# EAGLE schematic Rapide328smd (EAGLE 6.3)
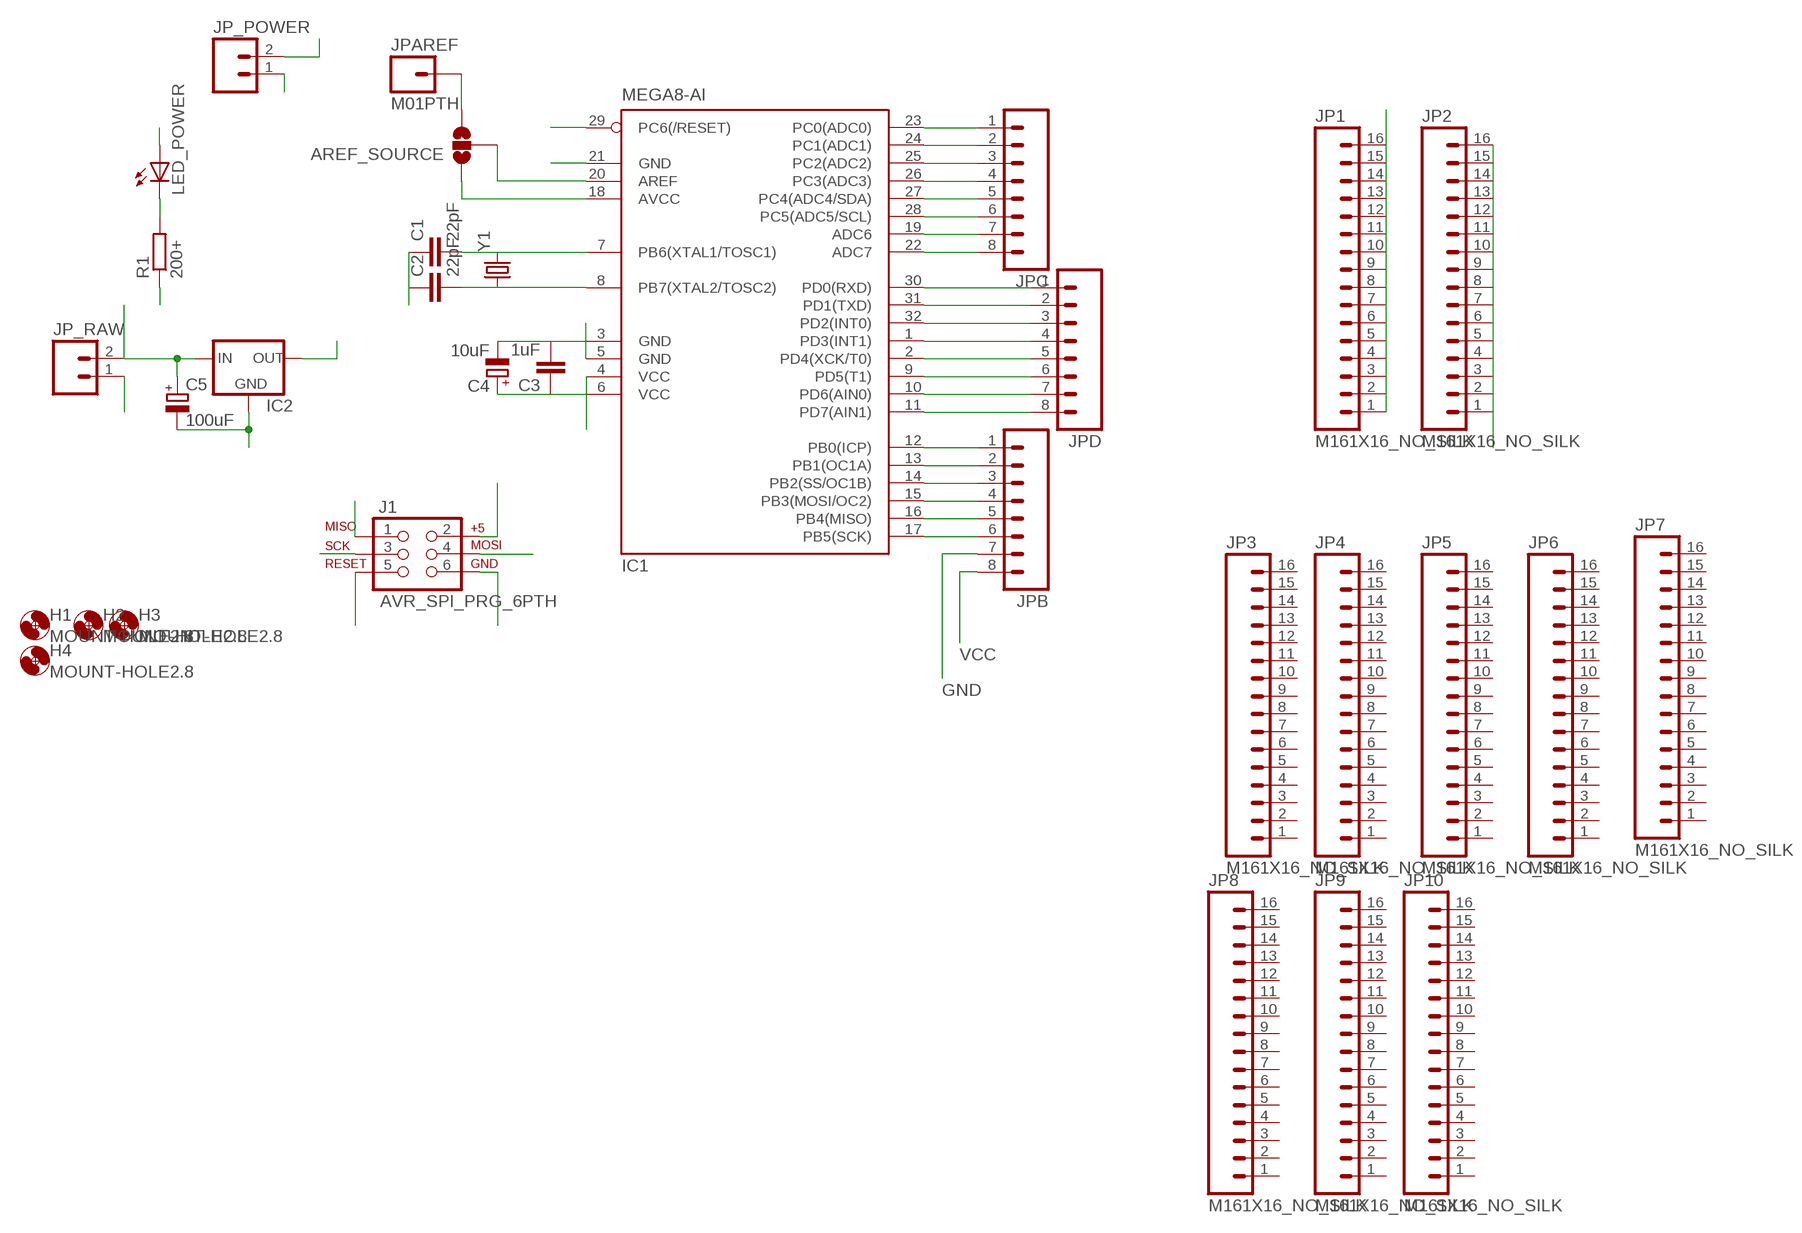
[diagram p0: schematic, sheet 1]

## Parts
AREF_SOURCE  SOLDERJUMPER_2WAYPASTE1&2  [SJ_3_PASTE1&2]
C1  22pF  C-EU025-024X044  [C025-024X044]
C2  22pF  C-EU025-024X044  [C025-024X044]
C3  1uF  C-EU025-024X044  [C025-024X044]
C4  10uF  CPOL-EUE2-5  [E2-5]
C5  100uF  CPOL-EUE2-5  [E2-5]
H1  MOUNT-HOLE2.8  [2,8]
H2  MOUNT-HOLE2.8  [2,8]
H3  MOUNT-HOLE2.8  [2,8]
H4  MOUNT-HOLE2.8  [2,8]
IC1  MEGA8-AI  [TQFP32-08]
IC2  V_REG_78XXSINK  [TO220-IGO]
J1  AVR_SPI_PRG_6PTH  [2X3]
JP1  M161X16_NO_SILK  [1X16_NO_SILK]
JP2  M161X16_NO_SILK  [1X16_NO_SILK]
JP3  M161X16_NO_SILK  [1X16_NO_SILK]
JP4  M161X16_NO_SILK  [1X16_NO_SILK]
JP5  M161X16_NO_SILK  [1X16_NO_SILK]
JP6  M161X16_NO_SILK  [1X16_NO_SILK]
JP7  M161X16_NO_SILK  [1X16_NO_SILK]
JP8  M161X16_NO_SILK  [1X16_NO_SILK]
JP9  M161X16_NO_SILK  [1X16_NO_SILK]
JP10  M161X16_NO_SILK  [1X16_NO_SILK]
JP_POWER  M02PTH3  [1X02_LONGPADS]
JP_RAW  M02PTH3  [1X02_LONGPADS]
JPAREF  M01PTH  [1X01]
JPB  M081X08  [1X08]
JPC  M081X08  [1X08]
JPD  M081X08  [1X08]
LED_POWER  LEDKA-3528ASYC  [KA-3528ASYC]
R1  200+  R-EU_0204/7  [0204/7]
Y1  CRYSTALHC49UV  [HC49U-V]

## Nets
GND: C1.1 C2.1 C3.2 C4.- C5.- IC1.3(GND) IC1.5(GND) IC1.21(GND) IC2.GND J1.6 JP2.1 JP2.2 JP2.3 JP2.4 JP2.5 JP2.6 JP2.7 JP2.8 JP2.9 JP2.10 JP2.11 JP2.12 JP2.13 JP2.14 JP2.15 JP2.16 JP_POWER.1 JP_RAW.1 JPB.7 R1.1
MISO: IC1.16(PB4(MISO)) J1.1 JPB.5
MOSI: IC1.15(PB3(MOSI/OC2)) J1.4 JPB.4
N$1: C1.2 IC1.7(PB6(XTAL1/TOSC1)) Y1.2
N$7: IC1.25(PC2(ADC2)) JPC.3
N$9: IC1.24(PC1(ADC1)) JPC.2
N$11: IC1.23(PC0(ADC0)) JPC.1
N$12: IC1.22(ADC7) JPC.8
N$13: IC1.12(PB0(ICP)) JPB.1
N$14: IC1.19(ADC6) JPC.7
N$15: IC1.28(PC5(ADC5/SCL)) JPC.6
N$16: IC1.27(PC4(ADC4/SDA)) JPC.5
N$17: IC1.26(PC3(ADC3)) JPC.4
N$18: AREF_SOURCE.2 IC1.20(AREF)
N$26: C2.2 IC1.8(PB7(XTAL2/TOSC2)) Y1.1
N$27: AREF_SOURCE.3 JPAREF.1
N$28: IC1.11(PD7(AIN1)) JPD.8
N$30: LED_POWER.C R1.2
N$32: IC1.10(PD6(AIN0)) JPD.7
N$34: IC1.13(PB1(OC1A)) JPB.2
N$36: IC1.9(PD5(T1)) JPD.6
N$38: IC1.14(PB2(SS/OC1B)) JPB.3
N$39: IC1.2(PD4(XCK/T0)) JPD.5
N$40: IC1.1(PD3(INT1)) JPD.4
N$41: IC1.32(PD2(INT0)) JPD.3
N$43: IC1.31(PD1(TXD)) JPD.2
N$44: IC1.30(PD0(RXD)) JPD.1
RESET: IC1.29(PC6(/RESET)) J1.5
SCK: IC1.17(PB5(SCK)) J1.3 JPB.6
VCC: AREF_SOURCE.1 C3.1 C4.+ IC1.4(VCC) IC1.6(VCC) IC1.18(AVCC) IC2.OUT J1.2 JP1.1 JP1.2 JP1.3 JP1.4 JP1.5 JP1.6 JP1.7 JP1.8 JP1.9 JP1.10 JP1.11 JP1.12 JP1.13 JP1.14 JP1.15 JP1.16 JP_POWER.2 JPB.8 LED_POWER.A
VRAW: C5.+ IC2.IN JP_RAW.2
Unconnected: JP3.1 JP3.2 JP3.3 JP3.4 JP3.5 JP3.6 JP3.7 JP3.8 JP3.9 JP3.10 JP3.11 JP3.12 JP3.13 JP3.14 JP3.15 JP3.16 JP4.1 JP4.2 JP4.3 JP4.4 JP4.5 JP4.6 JP4.7 JP4.8 JP4.9 JP4.10 JP4.11 JP4.12 JP4.13 JP4.14 JP4.15 JP4.16 JP5.1 JP5.2 JP5.3 JP5.4 JP5.5 JP5.6 JP5.7 JP5.8 JP5.9 JP5.10 JP5.11 JP5.12 JP5.13 JP5.14 JP5.15 JP5.16 JP6.1 JP6.2 JP6.3 JP6.4 JP6.5 JP6.6 JP6.7 JP6.8 JP6.9 JP6.10 JP6.11 JP6.12 JP6.13 JP6.14 JP6.15 JP6.16 JP7.1 JP7.2 JP7.3 JP7.4 JP7.5 JP7.6 JP7.7 JP7.8 JP7.9 JP7.10 JP7.11 JP7.12 JP7.13 JP7.14 JP7.15 JP7.16 JP8.1 JP8.2 JP8.3 JP8.4 JP8.5 JP8.6 JP8.7 JP8.8 JP8.9 JP8.10 JP8.11 JP8.12 JP8.13 JP8.14 JP8.15 JP8.16 JP9.1 JP9.2 JP9.3 JP9.4 JP9.5 JP9.6 JP9.7 JP9.8 JP9.9 JP9.10 JP9.11 JP9.12 JP9.13 JP9.14 JP9.15 JP9.16 JP10.1 JP10.2 JP10.3 JP10.4 JP10.5 JP10.6 JP10.7 JP10.8 JP10.9 JP10.10 JP10.11 JP10.12 JP10.13 JP10.14 JP10.15 JP10.16

## Library data of the parts
AREF_SOURCE = SparkFun-Passives:SOLDERJUMPER_2WAY: Solder Jumper 2 way solder jumper
C1-C3 = resistor:C-EU: CAPACITOR, European symbol
C4 C5 = resistor:CPOL-EU: POLARIZED CAPACITOR, European symbol
H1-H4 = holes:MOUNT-HOLE: MOUNTING HOLE with drill center marker
IC1 = atmel:MEGA8: MICROCONTROLLER 8 Kbytes FLASH, 1 kbytes SRAM, 512 bytes EEPROM, USART, 6-channel 10 bit ADC, 2-channel 8 bit ADC Pin compatible with Atmega48, ATMega88, ATMega168 Source: avr.lbr; MPN: ATMEGA8-16AU; OC_FARNELL: 9171371; OC_NEWARK: 73M8863
IC2 = SparkFun-PowerIC:V_REG_78XX: Voltage Regulator Standard 7805 5V regulator. IGO (Input Ground Output). Spark Fun Electronics SKU : COM-00107
J1 = SparkFun-Connectors:AVR_SPI_PRG_6: AVR ISP 6 Pin This is the reduced ISP connector for AVR programming. Common on Arduino. This footprint will take up less PCB space and can be used with a 10-pin to 6-pin adapter such as SKU: BOB-08508
JP1-JP10 = SparkFun-Connectors:M16: 1x16 .1" header
JP_POWER JP_RAW = SparkFun-Connectors:M02: Header 2 Standard 2-pin 0.1" header. Use with straight break away headers (SKU : PRT-00116), right angle break away headers (PRT-00553), swiss pins (PRT-00743), machine pins (PRT-00117), and female headers (PRT-00115). Molex polarized connector foot print use with SKU : PRT-08233 with associated crimp pins and housings.
JPAREF = SparkFun-Connectors:M01: Header 1 Standard 1-pin 0.1" header. Use with straight break away headers (SKU : PRT-00116), right angle break away headers (PRT-00553), swiss pins (PRT-00743), machine pins (PRT-00117), and female headers (PRT-00115).
JPB JPC JPD = SparkFun-Connectors:M08: Header 8 Standard 8-pin 0.1" header. Use with straight break away headers (SKU : PRT-00116), right angle break away headers (PRT-00553), swiss pins (PRT-00743), machine pins (PRT-00117), and female headers (PRT-00115).
LED_POWER = led:LED: LED OSRAM: - CHIPLED LG R971, LG N971, LY N971, LG Q971, LY Q971, LO R971, LY R971 LH N974, LH R974 LS Q976, LO Q976, LY Q976 LO Q996 - Hyper CHIPLED LW Q18S LB Q993, LB Q99A, LB R99A - SideLED LS A670, LO A670, LY A670, LG A670, LP A670 LB A673, LV A673, LT A673, LW A673 LH A674 LY A675 LS A676, LA A676, LO A676, LY A676, LW A676 LS A679, LY A679, LG A679 - Hyper Micro SIDELED® LS Y876, LA Y876, LO Y876, LY Y876 LT Y87S - SmartLED LW L88C, LW L88S LB L89C, LB L89S, LG L890 LS L89K, LO L89K, LY L89K LS L896, LA L896, LO L896, LY L896 - TOPLED LS T670, LO T670, LY T670, LG T670, LP T670 LSG T670, LSP T670, LSY T670, LOP T670, LYG T670 LG T671, LOG T671, LSG T671 LB T673, LV T673, LT T673, LW T673 LH T674 LS T676, LA T676, LO T676, LY T676, LB T676, LH T676, LSB T676, LW T676 LB T67C, LV T67C, LT T67C, LS T67K, LO T67K, LY T67K, LW E67C LS E67B, LA E67B, LO E67B, LY E67B, LB E67C, LV E67C, LT E67C LW T67C LS T679, LY T679, LG T679 LS T770, LO T770, LY T770, LG T770, LP T770 LB T773, LV T773, LT T773, LW T773 LH T774 LS E675, LA E675, LY E675, LS T675 LS T776, LA T776, LO T776, LY T776, LB T776 LHGB T686 LT T68C, LB T68C - Hyper Mini TOPLED® LB M676 - Mini TOPLED Santana® LG M470 LS M47K, LO M47K, LY M47K Source: http://www.osram.convergy.de LUXEON: - LUMILED® LXK2-PW12-R00, LXK2-PW12-S00, LXK2-PW14-U00, LXK2-PW14-V00 LXK2-PM12-R00, LXK2-PM12-S00, LXK2-PM14-U00 LXK2-PE12-Q00, LXK2-PE12-R00, LXK2-PE12-S00, LXK2-PE14-T00, LXK2-PE14-U00 LXK2-PB12-K00, LXK2-PB12-L00, LXK2-PB12-M00, LXK2-PB14-N00, LXK2-PB14-P00, LXK2-PB14-Q00 LXK2-PR12-L00, LXK2-PR12-M00, LXK2-PR14-Q00, LXK2-PR14-R00 LXK2-PD12-Q00, LXK2-PD12-R00, LXK2-PD12-S00 LXK2-PH12-R00, LXK2-PH12-S00 LXK2-PL12-P00, LXK2-PL12-Q00, LXK2-PL12-R00 Source: www.luxeon.com KINGBRIGHT: KA-3528ASYC Source: www.kingbright.com
R1 = resistor:R-EU_: RESISTOR, European symbol
Y1 = SparkFun-FreqCtrl:CRYSTAL: Various standard crystals. Proven footprints. Spark Fun Electronics SKU : COM-00534